# Altium schematic sheet MainSheet.SchDoc
size A
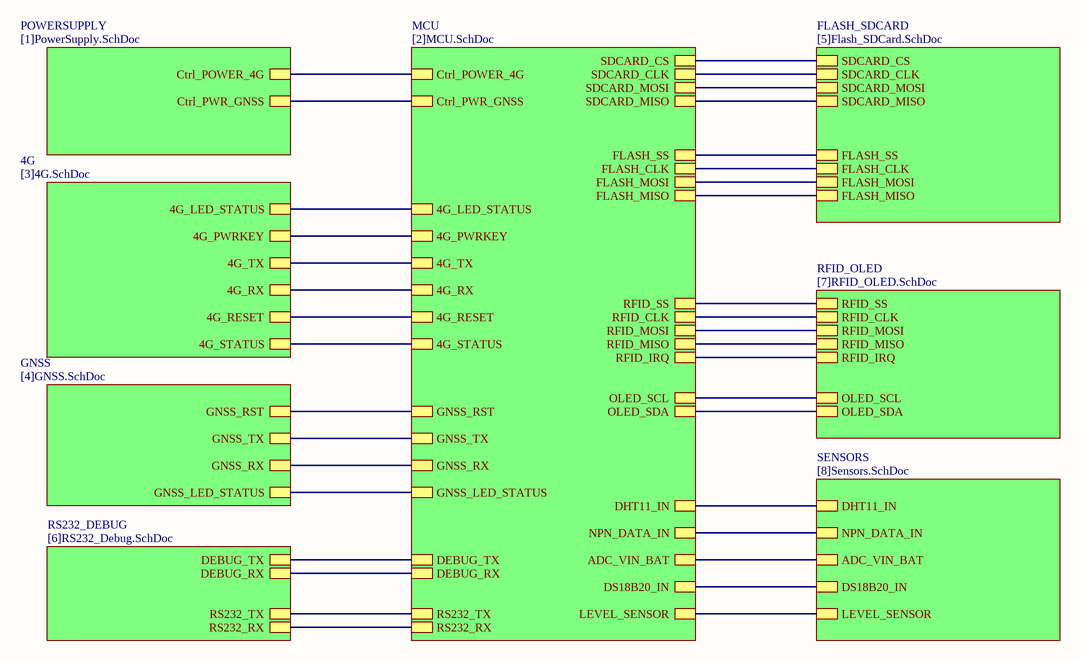
[diagram p0: MainSheet.SchDoc]

## Sub-sheets
4G = [3]4G.SchDoc: 4G_LED_STATUS, 4G_PWRKEY, 4G_TX, 4G_RX, 4G_RESET, 4G_STATUS
FLASH_SDCARD = [5]Flash_SDCard.SchDoc: SDCARD_CS, SDCARD_CLK, SDCARD_MISO, SDCARD_MOSI, FLASH_SS, FLASH_CLK, FLASH_MOSI, FLASH_MISO
GNSS = [4]GNSS.SchDoc: GNSS_RST, GNSS_TX, GNSS_RX, GNSS_LED_STATUS
MCU = [2]MCU.SchDoc: GNSS_LED_STATUS, 4G_LED_STATUS, GNSS_RST, GNSS_TX, GNSS_RX, 4G_TX, 4G_RX, 4G_STATUS, 4G_PWRKEY, RFID_IRQ, RS232_TX, RS232_RX, RFID_SS, RFID_CLK, RFID_MISO, RFID_MOSI, Ctrl_POWER_4G, Ctrl_PWR_GNSS, SDCARD_CS, DEBUG_TX, DEBUG_RX, SDCARD_CLK, SDCARD_MOSI, SDCARD_MISO, 4G_RESET, FLASH_SS, FLASH_CLK, FLASH_MOSI, FLASH_MISO, LEVEL_SENSOR, NPN_DATA_IN, ADC_VIN_BAT, DS18B20_IN, OLED_SCL, OLED_SDA, DHT11_IN
POWERSUPPLY = [1]PowerSupply.SchDoc: Ctrl_POWER_4G, Ctrl_PWR_GNSS
RFID_OLED = [7]RFID_OLED.SchDoc: RFID_SS, RFID_CLK, RFID_MOSI, RFID_MISO, RFID_IRQ, OLED_SCL, OLED_SDA
RS232_DEBUG = [6]RS232_Debug.SchDoc: RS232_TX, RS232_RX, DEBUG_TX, DEBUG_RX
SENSORS = [8]Sensors.SchDoc: NPN_DATA_IN, ADC_VIN_BAT, DS18B20_IN, LEVEL_SENSOR, DHT11_IN

## Nets
(unnamed): sheet MCU/GNSS_LED_STATUS, sheet GNSS/GNSS_LED_STATUS
(unnamed): sheet MCU/4G_LED_STATUS, sheet 4G/4G_LED_STATUS
(unnamed): sheet MCU/GNSS_RST, sheet GNSS/GNSS_RST
(unnamed): sheet MCU/GNSS_TX, sheet GNSS/GNSS_TX
(unnamed): sheet MCU/GNSS_RX, sheet GNSS/GNSS_RX
(unnamed): sheet MCU/4G_TX, sheet 4G/4G_TX
(unnamed): sheet MCU/4G_RX, sheet 4G/4G_RX
(unnamed): sheet MCU/4G_STATUS, sheet 4G/4G_STATUS
(unnamed): sheet MCU/4G_PWRKEY, sheet 4G/4G_PWRKEY
(unnamed): sheet MCU/RFID_IRQ, sheet RFID_OLED/RFID_IRQ
(unnamed): sheet MCU/RS232_TX, sheet RS232_DEBUG/RS232_TX
(unnamed): sheet MCU/RS232_RX, sheet RS232_DEBUG/RS232_RX
(unnamed): sheet MCU/RFID_SS, sheet RFID_OLED/RFID_SS
(unnamed): sheet MCU/RFID_CLK, sheet RFID_OLED/RFID_CLK
(unnamed): sheet MCU/RFID_MISO, sheet RFID_OLED/RFID_MISO
(unnamed): sheet MCU/RFID_MOSI, sheet RFID_OLED/RFID_MOSI
(unnamed): sheet MCU/Ctrl_POWER_4G, sheet POWERSUPPLY/Ctrl_POWER_4G
(unnamed): sheet MCU/Ctrl_PWR_GNSS, sheet POWERSUPPLY/Ctrl_PWR_GNSS
(unnamed): sheet MCU/SDCARD_CS, sheet FLASH_SDCARD/SDCARD_CS
(unnamed): sheet MCU/DEBUG_TX, sheet RS232_DEBUG/DEBUG_TX
(unnamed): sheet MCU/DEBUG_RX, sheet RS232_DEBUG/DEBUG_RX
(unnamed): sheet MCU/SDCARD_CLK, sheet FLASH_SDCARD/SDCARD_CLK
(unnamed): sheet MCU/SDCARD_MOSI, sheet FLASH_SDCARD/SDCARD_MOSI
(unnamed): sheet MCU/SDCARD_MISO, sheet FLASH_SDCARD/SDCARD_MISO
(unnamed): sheet MCU/4G_RESET, sheet 4G/4G_RESET
(unnamed): sheet MCU/FLASH_SS, sheet FLASH_SDCARD/FLASH_SS
(unnamed): sheet MCU/FLASH_CLK, sheet FLASH_SDCARD/FLASH_CLK
(unnamed): sheet MCU/FLASH_MOSI, sheet FLASH_SDCARD/FLASH_MOSI
(unnamed): sheet MCU/FLASH_MISO, sheet FLASH_SDCARD/FLASH_MISO
(unnamed): sheet MCU/LEVEL_SENSOR, sheet SENSORS/LEVEL_SENSOR
(unnamed): sheet MCU/NPN_DATA_IN, sheet SENSORS/NPN_DATA_IN
(unnamed): sheet MCU/ADC_VIN_BAT, sheet SENSORS/ADC_VIN_BAT
(unnamed): sheet MCU/DS18B20_IN, sheet SENSORS/DS18B20_IN
(unnamed): sheet MCU/OLED_SCL, sheet RFID_OLED/OLED_SCL
(unnamed): sheet MCU/OLED_SDA, sheet RFID_OLED/OLED_SDA
(unnamed): sheet MCU/DHT11_IN, sheet SENSORS/DHT11_IN